# Altium schematic sheet Low Pass Filter.SchDoc
size A
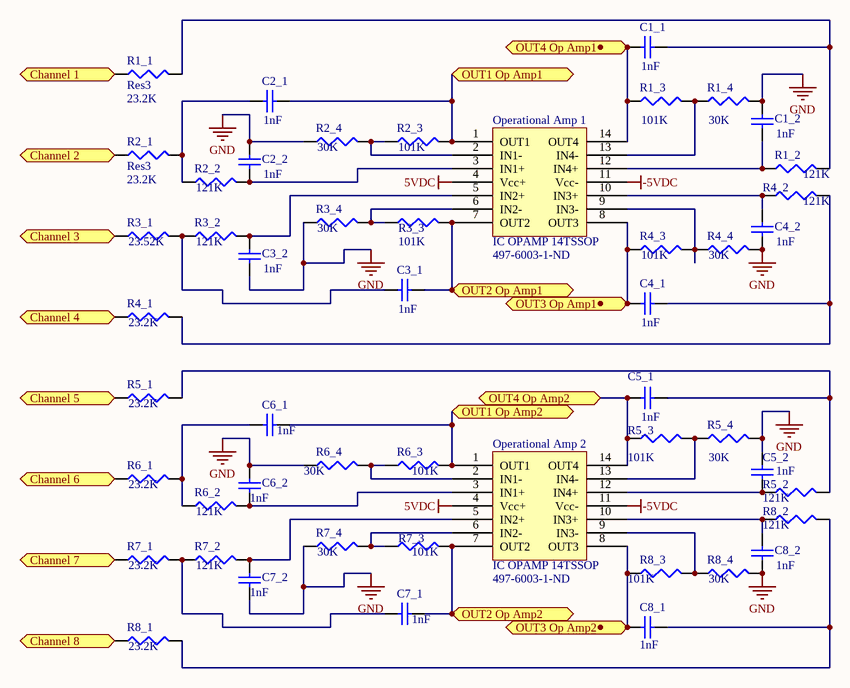
[diagram p0: Low Pass Filter.SchDoc]

## Parts
C1_1  value 1nF  [C1206]  (hidden comment: Cap Semi)
C1_2  value 1nF  [C1206]  (hidden comment: Cap Semi)
C2_1  value 1nF  [C1206]  (hidden comment: Cap Semi)
C2_2  value 1nF  [C1206]  (hidden comment: Cap Semi)
C3_1  value 1nF  [C1206]  (hidden comment: Cap Semi)
C3_2  value 1nF  [C1206]  (hidden comment: Cap Semi)
C4_1  value 1nF  [C1206]  (hidden comment: Cap Semi)
C4_2  value 1nF  [C1206]  (hidden comment: Cap Semi)
C5_1  value 1nF  [C1206]  (hidden comment: Cap Semi)
C5_2  value 1nF  [C1206]  (hidden comment: Cap Semi)
C6_1  value 1nF  [C1206]  (hidden comment: Cap Semi)
C6_2  value 1nF  [C1206]  (hidden comment: Cap Semi)
C7_1  value 1nF  [C1206]  (hidden comment: Cap Semi)
C7_2  value 1nF  [C1206]  (hidden comment: Cap Semi)
C8_1  value 1nF  [C1206]  (hidden comment: Cap Semi)
C8_2  value 1nF  [C1206]  (hidden comment: Cap Semi)
Operational_Amp_1  IC OPAMP 14TSSOP  Supplier Part Number 1: 497-6003-1-ND  [TSV994IPT]
Operational_Amp_2  IC OPAMP 14TSSOP  Supplier Part Number 1: 497-6003-1-ND  [TSV994IPT]
R1_1  Res3  value 23.2K  [J1-0603]
R1_2  value 121K  [J1-0603]  (hidden comment: Res3)
R1_3  value 101K  [J1-0603]  (hidden comment: Res3)
R1_4  value 30K  [J1-0603]  (hidden comment: Res3)
R2_1  Res3  value 23.2K  [J1-0603]
R2_2  value 121K  [J1-0603]  (hidden comment: Res3)
R2_3  value 101K  [J1-0603]  (hidden comment: Res3)
R2_4  value 30K  [J1-0603]  (hidden comment: Res3)
R3_1  value 23.52K  [J1-0603]  (hidden comment: Res3)
R3_2  value 121K  [J1-0603]  (hidden comment: Res3)
R3_3  value 101K  [J1-0603]  (hidden comment: Res3)
R3_4  value 30K  [J1-0603]  (hidden comment: Res3)
R4_1  value 23.2K  [J1-0603]  (hidden comment: Res3)
R4_2  value 121K  [J1-0603]  (hidden comment: Res3)
R4_3  value 101K  [J1-0603]  (hidden comment: Res3)
R4_4  value 30K  [J1-0603]  (hidden comment: Res3)
R5_1  value 23.2K  [J1-0603]  (hidden comment: Res3)
R5_2  value 121K  [J1-0603]  (hidden comment: Res3)
R5_3  value 101K  [J1-0603]  (hidden comment: Res3)
R5_4  value 30K  [J1-0603]  (hidden comment: Res3)
R6_1  value 23.2K  [J1-0603]  (hidden comment: Res3)
R6_2  value 121K  [J1-0603]  (hidden comment: Res3)
R6_3  value 101K  [J1-0603]  (hidden comment: Res3)
R6_4  value 30K  [J1-0603]  (hidden comment: Res3)
R7_1  value 23.2K  [J1-0603]  (hidden comment: Res3)
R7_2  value 121K  [J1-0603]  (hidden comment: Res3)
R7_3  value 101K  [J1-0603]  (hidden comment: Res3)
R7_4  value 30K  [J1-0603]  (hidden comment: Res3)
R8_1  value 23.2K  [J1-0603]  (hidden comment: Res3)
R8_2  value 121K  [J1-0603]  (hidden comment: Res3)
R8_3  value 101K  [J1-0603]  (hidden comment: Res3)
R8_4  value 30K  [J1-0603]  (hidden comment: Res3)

## Ports
Channel 1, Channel 2, Channel 3, Channel 4, Channel 5, Channel 6, Channel 7, Channel 8, OUT1 Op Amp1, OUT1 Op Amp2, OUT2 Op Amp1, OUT2 Op Amp2, OUT3 Op Amp1, OUT3 Op Amp2, OUT4 Op Amp1, OUT4 Op Amp2

## Nets
5VDC: Operational_Amp_1.4(Vcc+) Operational_Amp_2.4(Vcc+)
-5VDC: Operational_Amp_1.11(Vcc-) Operational_Amp_2.11(Vcc-)
GND: C1_2.1 C2_2.2 C3_2.1 C4_2.1 C5_2.2 C6_2.2 C7_2.1 C8_2.1 R1_4.2 R2_4.1 R3_4.1 R4_4.2 R5_4.2 R6_4.1 R7_4.1 R8_4.2
Channel 1: R1_1.1 ; port Channel 1
Channel 2: R2_1.1 ; port Channel 2
Channel 3: R3_1.1 ; port Channel 3
Channel 4: R4_1.1 ; port Channel 4
Channel 5: R5_1.1 ; port Channel 5
Channel 6: R6_1.1 ; port Channel 6
Channel 7: R7_1.1 ; port Channel 7
Channel 8: R8_1.1 ; port Channel 8
OUT1 Op Amp1: C2_1.2 Operational_Amp_1.1(OUT1) R2_3.2 ; port OUT1 Op Amp1
OUT1 Op Amp2: C6_1.2 Operational_Amp_2.1(OUT1) R6_3.2 ; port OUT1 Op Amp2
OUT2 Op Amp1: C3_1.2 Operational_Amp_1.7(OUT2) R3_3.2 ; port OUT2 Op Amp1
OUT2 Op Amp2: C7_1.2 Operational_Amp_2.7(OUT2) R7_3.2 ; port OUT2 Op Amp2
OUT3 Op Amp1: C4_1.1 Operational_Amp_1.8(OUT3) R4_3.1 ; port OUT3 Op Amp1
OUT3 Op Amp2: C8_1.2 Operational_Amp_2.8(OUT3) R8_3.1 ; port OUT3 Op Amp2
OUT4 Op Amp1: C1_1.1 Operational_Amp_1.14(OUT4) R1_3.1 ; port OUT4 Op Amp1
OUT4 Op Amp2: C5_1.1 Operational_Amp_2.14(OUT4) R5_3.1 ; port OUT4 Op Amp2
NetC1_1_2: C1_1.2 R1_1.2 R1_2.2
NetC1_2_2: C1_2.2 Operational_Amp_1.12(IN4+) R1_2.1
NetC2_1_1: C2_1.1 R2_1.2 R2_2.1
NetC2_2_1: C2_2.1 Operational_Amp_1.3(IN1+) R2_2.2
NetC3_1_1: C3_1.1 R3_1.2 R3_2.1
NetC3_2_2: C3_2.2 Operational_Amp_1.5(IN2+) R3_2.2
NetC4_1_2: C4_1.2 R4_1.2 R4_2.2
NetC4_2_2: C4_2.2 Operational_Amp_1.10(IN3+) R4_2.1
NetC5_1_2: C5_1.2 R5_1.2 R5_2.2
NetC5_2_1: C5_2.1 Operational_Amp_2.12(IN4+) R5_2.1
NetC6_1_1: C6_1.1 R6_1.2 R6_2.1
NetC6_2_1: C6_2.1 Operational_Amp_2.3(IN1+) R6_2.2
NetC7_1_1: C7_1.1 R7_1.2 R7_2.1
NetC7_2_2: C7_2.2 Operational_Amp_2.5(IN2+) R7_2.2
NetC8_1_1: C8_1.1 R8_1.2 R8_2.2
NetC8_2_2: C8_2.2 Operational_Amp_2.10(IN3+) R8_2.1
NetOperational_Amp_1_2: Operational_Amp_1.2(IN1-) R2_3.1 R2_4.2
NetOperational_Amp_1_6: Operational_Amp_1.6(IN2-) R3_3.1 R3_4.2
NetOperational_Amp_1_9: Operational_Amp_1.9(IN3-) R4_3.2 R4_4.1
NetOperational_Amp_1_13: Operational_Amp_1.13(IN4-) R1_3.2 R1_4.1
NetOperational_Amp_2_2: Operational_Amp_2.2(IN1-) R6_3.1 R6_4.2
NetOperational_Amp_2_6: Operational_Amp_2.6(IN2-) R7_3.1 R7_4.2
NetOperational_Amp_2_9: Operational_Amp_2.9(IN3-) R8_3.2 R8_4.1
NetOperational_Amp_2_13: Operational_Amp_2.13(IN4-) R5_3.2 R5_4.1

## Library data of the parts
C1_1 C1_2 C2_1 C2_2 C3_1 C3_2 C4_1 C4_2 C5_1 C5_2 C6_1 C6_2 C7_1 C7_2 C8_1 C8_2 = Cap Semi: Capacitor (Semiconductor SIM Model); Published: 8-Jun-2000; LatestRevisionDate: 29-May-2009; LatestRevisionNote: IPC-7351 Footprint Added.; PackageReference: C1206; Publisher: Altium Limited; PackageDescription: Chip Capacitor
Operational_Amp_1 Operational_Amp_2 = Component_1: Supplier 1: Digi-Key
R1_1-R1_4 R2_1-R2_4 R3_1-R3_4 R4_1-R4_4 R5_1-R5_4 R6_1-R6_4 R7_1-R7_4 R8_1-R8_4 = Res3: Resistor; Published: 8-Jun-2000; LatestRevisionDate: 29-May-2009; LatestRevisionNote: IPC-7351 Footprint Added.; PackageReference: J1-0603; Publisher: Altium Limited; PackageDescription: Chip Resistor